# EAGLE design bbb_audio_decoder (EAGLE 7.7.0)
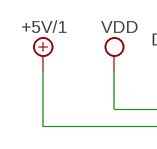
[diagram p0: schematic, sheet 1, part 1 of 2]
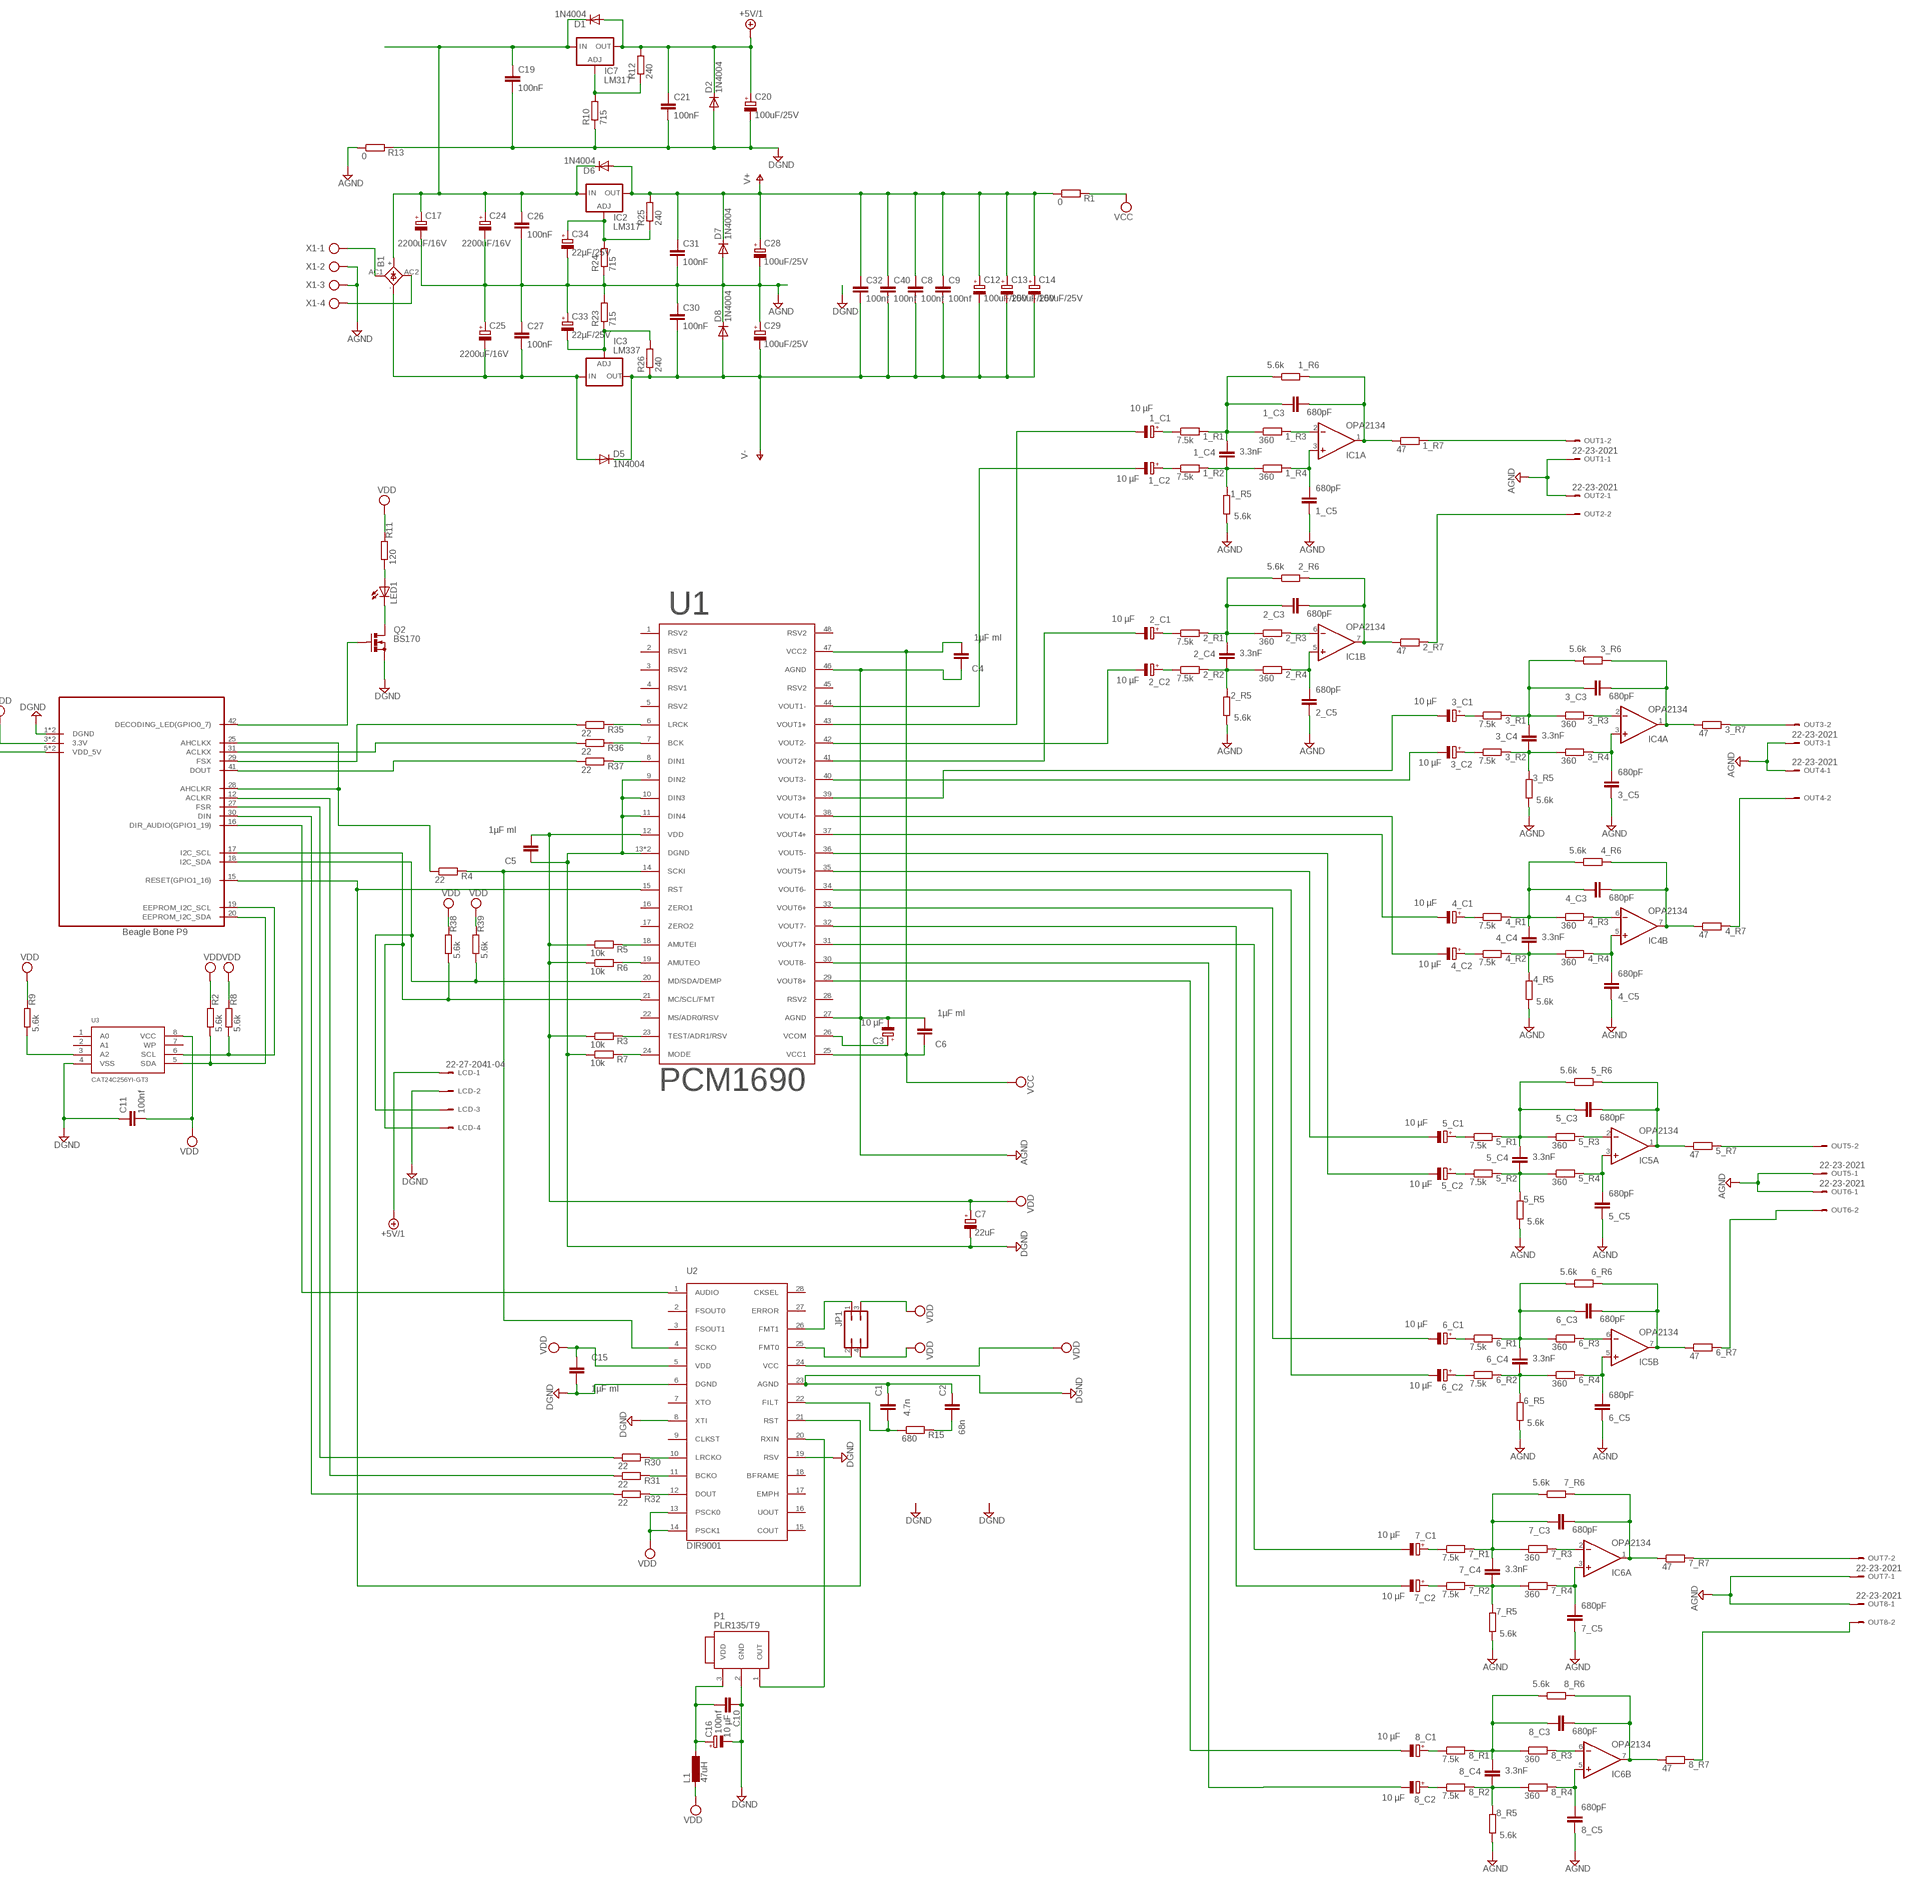
[diagram p1: schematic, sheet 1, part 2 of 2]

## Parts
1_C1  10 µF  CPOL-EUE2-5  [E2-5]
1_C2  10 µF  CPOL-EUE2-5  [E2-5]
1_C3  680pF  C-EU050-024X044  [C050-024X044]
1_C4  3.3nF  C-EU050-025X075  [C050-025X075]
1_C5  680pF  C-EU050-024X044  [C050-024X044]
1_R1  7.5k  R-EU_0207/7  [0207/7]
1_R2  7.5k  R-EU_0207/7  [0207/7]
1_R3  360  R-EU_0207/7  [0207/7]
1_R4  360  R-EU_0207/7  [0207/7]
1_R5  5.6k  R-EU_0207/7  [0207/7]
1_R6  5.6k  R-EU_0207/7  [0207/7]
1_R7  47  R-EU_0207/7  [0207/7]
2_C1  10 µF  CPOL-EUE2-5  [E2-5]
2_C2  10 µF  CPOL-EUE2-5  [E2-5]
2_C3  680pF  C-EU050-024X044  [C050-024X044]
2_C4  3.3nF  C-EU050-025X075  [C050-025X075]
2_C5  680pF  C-EU050-024X044  [C050-024X044]
2_R1  7.5k  R-EU_0207/7  [0207/7]
2_R2  7.5k  R-EU_0207/7  [0207/7]
2_R3  360  R-EU_0207/7  [0207/7]
2_R4  360  R-EU_0207/7  [0207/7]
2_R5  5.6k  R-EU_0207/7  [0207/7]
2_R6  5.6k  R-EU_0207/7  [0207/7]
2_R7  47  R-EU_0207/7  [0207/7]
3_C1  10 µF  CPOL-EUE2-5  [E2-5]
3_C2  10 µF  CPOL-EUE2-5  [E2-5]
3_C3  680pF  C-EU050-024X044  [C050-024X044]
3_C4  3.3nF  C-EU050-025X075  [C050-025X075]
3_C5  680pF  C-EU050-024X044  [C050-024X044]
3_R1  7.5k  R-EU_0207/7  [0207/7]
3_R2  7.5k  R-EU_0207/7  [0207/7]
3_R3  360  R-EU_0207/7  [0207/7]
3_R4  360  R-EU_0207/7  [0207/7]
3_R5  5.6k  R-EU_0207/7  [0207/7]
3_R6  5.6k  R-EU_0207/7  [0207/7]
3_R7  47  R-EU_0207/7  [0207/7]
4_C1  10 µF  CPOL-EUE2-5  [E2-5]
4_C2  10 µF  CPOL-EUE2-5  [E2-5]
4_C3  680pF  C-EU050-024X044  [C050-024X044]
4_C4  3.3nF  C-EU050-025X075  [C050-025X075]
4_C5  680pF  C-EU050-024X044  [C050-024X044]
4_R1  7.5k  R-EU_0207/7  [0207/7]
4_R2  7.5k  R-EU_0207/7  [0207/7]
4_R3  360  R-EU_0207/7  [0207/7]
4_R4  360  R-EU_0207/7  [0207/7]
4_R5  5.6k  R-EU_0207/7  [0207/7]
4_R6  5.6k  R-EU_0207/7  [0207/7]
4_R7  47  R-EU_0207/7  [0207/7]
5_C1  10 µF  CPOL-EUE2-5  [E2-5]
5_C2  10 µF  CPOL-EUE2-5  [E2-5]
5_C3  680pF  C-EU050-024X044  [C050-024X044]
5_C4  3.3nF  C-EU050-025X075  [C050-025X075]
5_C5  680pF  C-EU050-024X044  [C050-024X044]
5_R1  7.5k  R-EU_0207/7  [0207/7]
5_R2  7.5k  R-EU_0207/7  [0207/7]
5_R3  360  R-EU_0207/7  [0207/7]
5_R4  360  R-EU_0207/7  [0207/7]
5_R5  5.6k  R-EU_0207/7  [0207/7]
5_R6  5.6k  R-EU_0207/7  [0207/7]
5_R7  47  R-EU_0207/7  [0207/7]
6_C1  10 µF  CPOL-EUE2-5  [E2-5]
6_C2  10 µF  CPOL-EUE2-5  [E2-5]
6_C3  680pF  C-EU050-024X044  [C050-024X044]
6_C4  3.3nF  C-EU050-025X075  [C050-025X075]
6_C5  680pF  C-EU050-024X044  [C050-024X044]
6_R1  7.5k  R-EU_0207/7  [0207/7]
6_R2  7.5k  R-EU_0207/7  [0207/7]
6_R3  360  R-EU_0207/7  [0207/7]
6_R4  360  R-EU_0207/7  [0207/7]
6_R5  5.6k  R-EU_0207/7  [0207/7]
6_R6  5.6k  R-EU_0207/7  [0207/7]
6_R7  47  R-EU_0207/7  [0207/7]
7_C1  10 µF  CPOL-EUE2-5  [E2-5]
7_C2  10 µF  CPOL-EUE2-5  [E2-5]
7_C3  680pF  C-EU050-024X044  [C050-024X044]
7_C4  3.3nF  C-EU050-025X075  [C050-025X075]
7_C5  680pF  C-EU050-024X044  [C050-024X044]
7_R1  7.5k  R-EU_0207/7  [0207/7]
7_R2  7.5k  R-EU_0207/7  [0207/7]
7_R3  360  R-EU_0207/7  [0207/7]
7_R4  360  R-EU_0207/7  [0207/7]
7_R5  5.6k  R-EU_0207/7  [0207/7]
7_R6  5.6k  R-EU_0207/7  [0207/7]
7_R7  47  R-EU_0207/7  [0207/7]
8_C1  10 µF  CPOL-EUE2-5  [E2-5]
8_C2  10 µF  CPOL-EUE2-5  [E2-5]
8_C3  680pF  C-EU050-024X044  [C050-024X044]
8_C4  3.3nF  C-EU050-025X075  [C050-025X075]
8_C5  680pF  C-EU050-024X044  [C050-024X044]
8_R1  7.5k  R-EU_0207/7  [0207/7]
8_R2  7.5k  R-EU_0207/7  [0207/7]
8_R3  360  R-EU_0207/7  [0207/7]
8_R4  360  R-EU_0207/7  [0207/7]
8_R5  5.6k  R-EU_0207/7  [0207/7]
8_R6  5.6k  R-EU_0207/7  [0207/7]
8_R7  47  R-EU_0207/7  [0207/7]
B1  FB15  [FB15]
C1  4.7n  C-EU050-024X044  [C050-024X044]
C2  68n  C-EU050-024X044  [C050-024X044]
C3  10 µF  CPOL-EUE2-5  [E2-5]
C4  1µF ml  C-EU050-024X044  [C050-024X044]
C5  1µF ml  C-EU050-024X044  [C050-024X044]
C6  1µF ml  C-EU050-024X044  [C050-024X044]
C7  22uF  CPOL-EUE2-5  [E2-5]
C8  100nf  C-EU050-024X044  [C050-024X044]
C9  100nf  C-EU050-024X044  [C050-024X044]
C10  100nf  C-EU050-024X044  [C050-024X044]
C11  100nf  C-EU050-024X044  [C050-024X044]
C12  100uF/25V  CPOL-EUE2.5-6  [E2,5-6]
C13  100uF/25V  CPOL-EUE2.5-6  [E2,5-6]
C14  100uF/25V  CPOL-EUE2.5-6  [E2,5-6]
C15  1µF ml  C-EU050-024X044  [C050-024X044]
C16  10 µF  CPOL-EUE2-5  [E2-5]
C17  2200uF/16V  CPOL-EUE5-13  [E5-13]
C19  100nF  C-EU050-024X044  [C050-024X044]
C20  100uF/25V  CPOL-EUE2.5-6  [E2,5-6]
C21  100nF  C-EU050-024X044  [C050-024X044]
C24  2200uF/16V  CPOL-EUE5-13  [E5-13]
C25  2200uF/16V  CPOL-EUE5-13  [E5-13]
C26  100nF  C-EU050-024X044  [C050-024X044]
C27  100nF  C-EU050-024X044  [C050-024X044]
C28  100uF/25V  CPOL-EUE2.5-6  [E2,5-6]
C29  100uF/25V  CPOL-EUE2.5-6  [E2,5-6]
C30  100nF  C-EU050-024X044  [C050-024X044]
C31  100nF  C-EU050-024X044  [C050-024X044]
C32  100nf  C-EU050-024X044  [C050-024X044]
C33  22µF/25V  CPOL-EUE2.5-6  [E2,5-6]
C34  22µF/25V  CPOL-EUE2.5-6  [E2,5-6]
C40  100nf  C-EU050-024X044  [C050-024X044]
D1  1N4004  DIODE-DO41-7.6  [DO41-7.6]
D2  1N4004  DIODE-DO41-7.6  [DO41-7.6]
D5  1N4004  DIODE-DO41-7.6  [DO41-7.6]
D6  1N4004  DIODE-DO41-7.6  [DO41-7.6]
D7  1N4004  DIODE-DO41-7.6  [DO41-7.6]
D8  1N4004  DIODE-DO41-7.6  [DO41-7.6]
IC1  OPA2134  TL072P  [DIL8]
IC2  LM317  LM317TS  [317TS]
IC3  LM337  LM337TS  [337TS]
IC4  OPA2134  TL072P  [DIL8]
IC5  OPA2134  TL072P  [DIL8]
IC6  OPA2134  TL072P  [DIL8]
IC7  LM317  LM317TS  [317TS]
JP1  JP2Q  [JP2Q]
L1  47uH  L-EU0207/10  [0207/10]
LCD  22-27-2041-04  [6410-04]
LED1  LEDSMT1206  [1206]
OUT1  22-23-2021  [22-23-2021]
OUT2  22-23-2021  [22-23-2021]
OUT3  22-23-2021  [22-23-2021]
OUT4  22-23-2021  [22-23-2021]
OUT5  22-23-2021  [22-23-2021]
OUT6  22-23-2021  [22-23-2021]
OUT7  22-23-2021  [22-23-2021]
OUT8  22-23-2021  [22-23-2021]
P1  PLR135/T9  [PLR135/T9]
Q2  BS170  [SOT54E]
R1  0  R-EU_0204/2V  [0204V]
R2  5.6k  R-EU_0207/7  [0207/7]
R3  10k  R-EU_0207/7  [0207/7]
R4  22  R-EU_0207/7  [0207/7]
R5  10k  R-EU_0207/7  [0207/7]
R6  10k  R-EU_0207/7  [0207/7]
R7  10k  R-EU_0207/7  [0207/7]
R8  5.6k  R-EU_0207/7  [0207/7]
R9  5.6k  R-EU_0207/7  [0207/7]
R10  715  R-EU_0204/2V  [0204V]
R11  120  R-EU_0204/2V  [0204V]
R12  240  R-EU_0204/2V  [0204V]
R13  0  R-EU_0204/2V  [0204V]
R15  680  R-EU_0207/7  [0207/7]
R23  715  R-EU_0204/2V  [0204V]
R24  715  R-EU_0207/10  [0207/10]
R25  240  R-EU_0204/2V  [0204V]
R26  240  R-EU_0204/2V  [0204V]
R30  22  R-EU_0207/7  [0207/7]
R31  22  R-EU_0207/7  [0207/7]
R32  22  R-EU_0207/7  [0207/7]
R35  22  R-EU_0207/7  [0207/7]
R36  22  R-EU_0207/7  [0207/7]
R37  22  R-EU_0207/7  [0207/7]
R38  5.6k  R-EU_0207/7  [0207/7]
R39  5.6k  R-EU_0207/7  [0207/7]
U1  PCM1690  [HTSSOP48DFD]
U2  DIR9001  [TSSOP28]
U3  CAT24C256YI-GT3  [TSSOP8]
U$1  BEAGLEBONEP9  [HEADERS23-2]
X1  AK500/4  [AK500/4]

## Nets
ACLKR: R31.1 U$1.12(ACLKR)
ACLKX: R36.1 U$1.31(ACLKX)
AGND: 1_C5.1 1_R5.1 2_C5.1 2_R5.1 3_C5.1 3_R5.1 4_C5.1 4_R5.1 5_C5.1 5_R5.1 6_C5.1 6_R5.1 7_C5.1 7_R5.1 8_C5.1 8_R5.1 C3.- C4.1 C6.2 C17.- C24.- C25.+ C26.2 C27.1 C28.- C29.+ C30.1 C31.2 C33.+ C34.- D7.A D8.C OUT1.1 OUT2.1 OUT3.1 OUT4.1 OUT5.1 OUT6.1 OUT7.1 OUT8.1 R13.1 R23.2 R24.1 U1.27(AGND) U1.46(AGND) X1.2 X1.3
CAPE_I2C_SCL: R8.1 U3.6(SCL) U$1.19(EEPROM_I2C_SCL)
CAPE_I2C_SDA: R2.1 U3.5(SDA) U$1.20(EEPROM_I2C_SDA)
DGND: C1.1 C2.1 C5.1 C7.- C10.1 C11.1 C15.2 C16.- C19.2 C20.- C21.2 D2.A LCD.2 P1.2(GND) Q2.S R7.1 R10.1 R13.2 U1.9(DIN2) U1.10(DIN3) U1.11(DIN4) U1.13(DGND) U1.EXP(DGND) U2.6(DGND) U2.8(XTI) U2.19(RSV) U2.23(AGND) U3.4(VSS) U$1.1(DGND) U$1.2(DGND)
DIN: R32.1 U$1.30(DIN)
DIR_AUDIO: U2.1(AUDIO) U$1.16(DIR_AUDIO(GPIO1_19))
DOUT: R37.1 U$1.41(DOUT)
FILT: C1.2 R15.1 U2.22(FILT)
FSR: R30.1 U$1.27(FSR)
FSX: R35.1 U$1.29(FSX)
MCLK: R4.1 U$1.25(AHCLKX) U$1.28(AHCLKR)
N$1: B1.AC2 X1.4
N$2: R3.2 U1.23(TEST/ADR1/RSV)
N$3: B1.AC1 X1.1
N$4: LED1.A R11.1
N$5: R4.2 U1.14(SCKI) U2.4(SCKO)
N$6: C2.2 R15.2
N$7: JP1.2 U2.25(FMT0)
N$8: JP1.1 U2.26(FMT1)
N$9: 3_C4.1 3_R2.2 3_R4.1 3_R5.2
N$10: 3_C3.1 3_C4.2 3_R1.2 3_R3.1 3_R6.1
N$11: R5.2 U1.18(AMUTEI)
N$12: C10.2 C16.+ L1.1 P1.3(VDD)
N$13: 1_C4.1 1_R2.2 1_R4.1 1_R5.2
N$14: 2_C4.1 2_R2.2 2_R4.1 2_R5.2
N$15: 2_C3.1 2_C4.2 2_R1.2 2_R3.1 2_R6.1
N$16: 3_C5.2 3_R4.2 IC4.3(A:+IN)
N$17: R6.2 U1.19(AMUTEO)
N$18: 1_C3.1 1_C4.2 1_R1.2 1_R3.1 1_R6.1
N$19: R7.2 U1.24(MODE)
N$20: P1.1(OUT) U2.20(RXIN)
N$21: 3_C3.2 3_R6.2 3_R7.1 IC4.1(A:OUT)
N$22: 3_R3.2 IC4.2(A:-IN)
N$23: 1_R3.2 IC1.2(A:-IN)
N$24: 1_C5.2 1_R4.2 IC1.3(A:+IN)
N$25: 1_C2.+ 1_R2.1
N$26: 1_C3.2 1_R6.2 1_R7.1 IC1.1(A:OUT)
N$27: 1_C1.+ 1_R1.1
N$28: LED1.C Q2.D
N$29: 7_C4.1 7_R2.2 7_R4.1 7_R5.2
N$30: 2_C5.2 2_R4.2 IC1.5(B:+IN)
N$31: 2_C3.2 2_R6.2 2_R7.1 IC1.7(B:OUT)
N$32: 2_R3.2 IC1.6(B:-IN)
N$33: 2_C2.+ 2_R2.1
N$34: 2_C1.+ 2_R1.1
N$35: 7_C3.1 7_C4.2 7_R1.2 7_R3.1 7_R6.1
N$36: 7_C5.2 7_R4.2 IC6.3(A:+IN)
N$37: 1_R7.2 OUT1.2
N$38: 2_R7.2 OUT2.2
N$39: B1.+ C17.+ C19.1 C24.+ C26.1 D1.C D6.C IC2.3(IN) IC7.3(IN)
N$40: IC7.1(ADJ) R10.2 R12.1
N$41: B1.- C25.- C27.2 D5.A IC3.2(IN)
N$42: C33.- IC3.1(ADJ) R23.1 R26.2
N$43: C34.+ IC2.1(ADJ) R24.2 R25.1
N$44: 3_C2.+ 3_R2.1
N$45: 3_C1.+ 3_R1.1
N$46: 7_C3.2 7_R6.2 7_R7.1 IC6.1(A:OUT)
N$47: 7_R3.2 IC6.2(A:-IN)
N$48: 4_C4.1 4_R2.2 4_R4.1 4_R5.2
N$49: 4_C3.1 4_C4.2 4_R1.2 4_R3.1 4_R6.1
N$50: 4_C5.2 4_R4.2 IC4.5(B:+IN)
N$51: R32.2 U2.12(DOUT)
N$52: R31.2 U2.11(BCKO)
N$53: R30.2 U2.10(LRCKO)
N$54: R9.1 U3.3(A2)
N$55: 4_C3.2 4_R6.2 4_R7.1 IC4.7(B:OUT)
N$56: 4_R3.2 IC4.6(B:-IN)
N$57: 4_C2.+ 4_R2.1
N$58: 4_C1.+ 4_R1.1
N$59: 7_C2.+ 7_R2.1
N$60: 7_C1.+ 7_R1.1
N$61: R37.2 U1.8(DIN1)
N$62: R36.2 U1.7(BCK)
N$63: R35.2 U1.6(LRCK)
N$64: 3_R7.2 OUT3.2
N$65: 4_R7.2 OUT4.2
N$66: 5_C4.1 5_R2.2 5_R4.1 5_R5.2
N$67: 5_C3.1 5_C4.2 5_R1.2 5_R3.1 5_R6.1
N$68: 5_C5.2 5_R4.2 IC5.3(A:+IN)
N$69: 5_C3.2 5_R6.2 5_R7.1 IC5.1(A:OUT)
N$70: 5_R3.2 IC5.2(A:-IN)
N$71: 5_C2.+ 5_R2.1
N$72: 5_C1.+ 5_R1.1
N$73: 8_C4.1 8_R2.2 8_R4.1 8_R5.2
N$74: 8_C3.1 8_C4.2 8_R1.2 8_R3.1 8_R6.1
N$75: 6_C4.1 6_R2.2 6_R4.1 6_R5.2
N$76: 6_C3.1 6_C4.2 6_R1.2 6_R3.1 6_R6.1
N$77: 6_C5.2 6_R4.2 IC5.5(B:+IN)
N$78: 6_C3.2 6_R6.2 6_R7.1 IC5.7(B:OUT)
N$79: 6_R3.2 IC5.6(B:-IN)
N$80: 6_C2.+ 6_R2.1
N$81: 6_C1.+ 6_R1.1
N$82: 5_R7.2 OUT5.2
N$83: 6_R7.2 OUT6.2
N$84: 8_C5.2 8_R4.2 IC6.5(B:+IN)
N$85: 8_C3.2 8_R6.2 8_R7.1 IC6.7(B:OUT)
N$86: 8_R3.2 IC6.6(B:-IN)
N$87: 8_C2.+ 8_R2.1
N$88: 8_C1.+ 8_R1.1
N$89: 7_R7.2 OUT7.2
N$90: 8_R7.2 OUT8.2
N$94: Q2.G U$1.42(DECODING_LED(GPIO0_7))
RST: U1.15(RST) U2.21(RST) U$1.15(RESET(GPIO1_16))
SCL: LCD.4 R38.1 U1.21(MC/SCL/FMT) U$1.17(I2C_SCL)
SDA: LCD.3 R39.1 U1.20(MD/SDA/DEMP) U$1.18(I2C_SDA)
V+: C8.1 C9.1 C12.+ C13.+ C14.+ C28.+ C31.1 C32.1 C40.1 D6.A D7.C IC2.2(OUT) R1.1 R25.2
V-: C8.2 C9.2 C12.- C13.- C14.- C29.- C30.2 C32.2 C40.2 D5.C D8.A IC3.3(OUT) R26.1
VCC: C4.2 C6.1 R1.2 U1.25(VCC1) U1.47(VCC2)
VCOM: C3.+ U1.26(VCOM)
VDD: C5.2 C7.+ C11.2 C15.1 JP1.3 JP1.4 L1.2 R2.2 R3.1 R5.1 R6.1 R8.2 R9.2 R11.2 R38.2 R39.2 U1.12(VDD) U2.5(VDD) U2.13(PSCK0) U2.14(PSCK1) U2.24(VCC) U3.8(VCC) U$1.3(3.3V) U$1.4(3.3V)
VDD_5V: C20.+ C21.1 D1.A D2.C IC7.2(OUT) LCD.1 R12.2 U$1.5(VDD_5V) U$1.6(VDD_5V) ; supply symbol labelled +5V/1
VOUT1+: 1_C1.- U1.43(VOUT1+)
VOUT1-: 1_C2.- U1.44(VOUT1-)
VOUT2+: 2_C1.- U1.41(VOUT2+)
VOUT2-: 2_C2.- U1.42(VOUT2-)
VOUT3+: 3_C1.- U1.39(VOUT3+)
VOUT3-: 3_C2.- U1.40(VOUT3-)
VOUT4+: 4_C1.- U1.37(VOUT4+)
VOUT4-: 4_C2.- U1.38(VOUT4-)
VOUT5+: 5_C1.- U1.35(VOUT5+)
VOUT5-: 5_C2.- U1.36(VOUT5-)
VOUT6+: 6_C1.- U1.33(VOUT6+)
VOUT6-: 6_C2.- U1.34(VOUT6-)
VOUT7+: 7_C1.- U1.31(VOUT7+)
VOUT7-: 7_C2.- U1.32(VOUT7-)
VOUT8+: 8_C1.- U1.29(VOUT8+)
VOUT8-: 8_C2.- U1.30(VOUT8-)
Unconnected: U1.1(RSV2) U1.2(RSV1) U1.3(RSV2) U1.4(RSV1) U1.5(RSV2) U1.16(ZERO1) U1.17(ZERO2) U1.22(MS/ADR0/RSV) U1.28(RSV2) U1.45(RSV2) U1.48(RSV2) U2.2(FSOUT0) U2.3(FSOUT1) U2.7(XTO) U2.9(CLKST) U2.15(COUT) U2.16(UOUT) U2.17(EMPH) U2.18(BFRAME) U2.27(ERROR) U2.28(CKSEL) U3.1(A0) U3.2(A1) U3.7(WP)

## Power pins joined to a net without a drawn wire
V+: IC1.8(P:V+) IC4.8(P:V+) IC5.8(P:V+) IC6.8(P:V+)
V-: IC1.4(P:V-) IC4.4(P:V-) IC5.4(P:V-) IC6.4(P:V-)

## Library data of the parts
1_C1 1_C2 2_C1 2_C2 3_C1 3_C2 4_C1 4_C2 5_C1 5_C2 6_C1 6_C2 7_C1 7_C2 8_C1 8_C2 C3 C7 C12-C14 C16 C17 C20 C24 C25 C28 C29 C33 C34 = rcl:CPOL-EU: POLARIZED CAPACITOR, European symbol
1_C3-1_C5 2_C3-2_C5 3_C3-3_C5 4_C3-4_C5 5_C3-5_C5 6_C3-6_C5 7_C3-7_C5 8_C3-8_C5 C1 C2 C4-C6 C8-C11 C15 C19 C21 C26 C27 C30-C32 C40 = rcl:C-EU: CAPACITOR, European symbol
1_R1-1_R7 2_R1-2_R7 3_R1-3_R7 4_R1-4_R7 5_R1-5_R7 6_R1-6_R7 7_R1-7_R7 8_R1-8_R7 R1-R13 R15 R23-R26 R30-R32 R35-R39 = rcl:R-EU_: RESISTOR, European symbol
B1 = rectifier:FB15: FAGOR RECTIFIER grid 3 x 5 mm
D1 D2 D5-D8 = diode:DIODE-: DIODE
IC1 IC4-IC6 = 0000halfgaar:TL072: TL072 dual opamp
IC2 IC7 = v-reg:LM317TS: VOLTAGE REGULATOR
IC3 = v-reg:LM337TS: VOLTAGE REGULATOR
JP1 = jumper:JP2Q: JUMPER
L1 = rcl:L-EU: INDUCTOR, European symbol
LCD = con-molex:22-?-04: CONNECTOR wire to board 2.54 mm (.1 inch) pitch header; OC_FARNELL: unknown; OC_NEWARK: unknown
LED1 = led:LED: LED OSRAM: - CHIPLED LG R971, LG N971, LY N971, LG Q971, LY Q971, LO R971, LY R971 LH N974, LH R974 LS Q976, LO Q976, LY Q976 LO Q996 - Hyper CHIPLED LW Q18S LB Q993, LB Q99A, LB R99A - SideLED LS A670, LO A670, LY A670, LG A670, LP A670 LB A673, LV A673, LT A673, LW A673 LH A674 LY A675 LS A676, LA A676, LO A676, LY A676, LW A676 LS A679, LY A679, LG A679 - Hyper Micro SIDELED® LS Y876, LA Y876, LO Y876, LY Y876 LT Y87S - SmartLED LW L88C, LW L88S LB L89C, LB L89S, LG L890 LS L89K, LO L89K, LY L89K LS L896, LA L896, LO L896, LY L896 - TOPLED LS T670, LO T670, LY T670, LG T670, LP T670 LSG T670, LSP T670, LSY T670, LOP T670, LYG T670 LG T671, LOG T671, LSG T671 LB T673, LV T673, LT T673, LW T673 LH T674 LS T676, LA T676, LO T676, LY T676, LB T676, LH T676, LSB T676, LW T676 LB T67C, LV T67C, LT T67C, LS T67K, LO T67K, LY T67K, LW E67C LS E67B, LA E67B, LO E67B, LY E67B, LB E67C, LV E67C, LT E67C LW T67C LS T679, LY T679, LG T679 LS T770, LO T770, LY T770, LG T770, LP T770 LB T773, LV T773, LT T773, LW T773 LH T774 LS E675, LA E675, LY E675, LS T675 LS T776, LA T776, LO T776, LY T776, LB T776 LHGB T686 LT T68C, LB T68C - Hyper Mini TOPLED® LB M676 - Mini TOPLED Santana® LG M470 LS M47K, LO M47K, LY M47K Source: http://www.osram.convergy.de LUXEON: - LUMILED® LXK2-PW12-R00, LXK2-PW12-S00, LXK2-PW14-U00, LXK2-PW14-V00 LXK2-PM12-R00, LXK2-PM12-S00, LXK2-PM14-U00 LXK2-PE12-Q00, LXK2-PE12-R00, LXK2-PE12-S00, LXK2-PE14-T00, LXK2-PE14-U00 LXK2-PB12-K00, LXK2-PB12-L00, LXK2-PB12-M00, LXK2-PB14-N00, LXK2-PB14-P00, LXK2-PB14-Q00 LXK2-PR12-L00, LXK2-PR12-M00, LXK2-PR14-Q00, LXK2-PR14-R00 LXK2-PD12-Q00, LXK2-PD12-R00, LXK2-PD12-S00 LXK2-PH12-R00, LXK2-PH12-S00 LXK2-PL12-P00, LXK2-PL12-Q00, LXK2-PL12-R00 Source: www.luxeon.com KINGBRIGHT: KA-3528ASYC Source: www.kingbright.com
OUT1-OUT8 = con-molex:22-23-2021: .100" (2.54mm) Center Header - 2 Pin; MF: MOLEX; MPN: 22-23-2021; OC_FARNELL: 1462926; OC_NEWARK: 25C3832
P1 = 0000halfgaar:PLR135/T9: PLR135/T9 Optical Receiver
Q2 = transistor-small-signal:BS170: N-CHANNEL MOS FET
U1 = 0000halfgaar:PCM1690: PCM1690 24-Bit, 192-kHz Sampling, Enhanced Multi-Level ΔΣ, Eight-Channel Audio Digital-to-Analog Converter
U2 = 0000halfgaar:DIR9001: DIR9001 DIR9001 Digital audio interface receiver
U3 = 0000halfgaar:CAT24C256: CAT24C256 EEPROM, the one the Beagle Bone Black wants
U$1 = 0000halfgaar:BEAGLEBONEP9: Beagle Bone green/black P9 I2s / mcasp function
X1 = con-ptr500:AK500/4: CONNECTOR; OC_FARNELL: unknown; OC_NEWARK: unknown

## Board
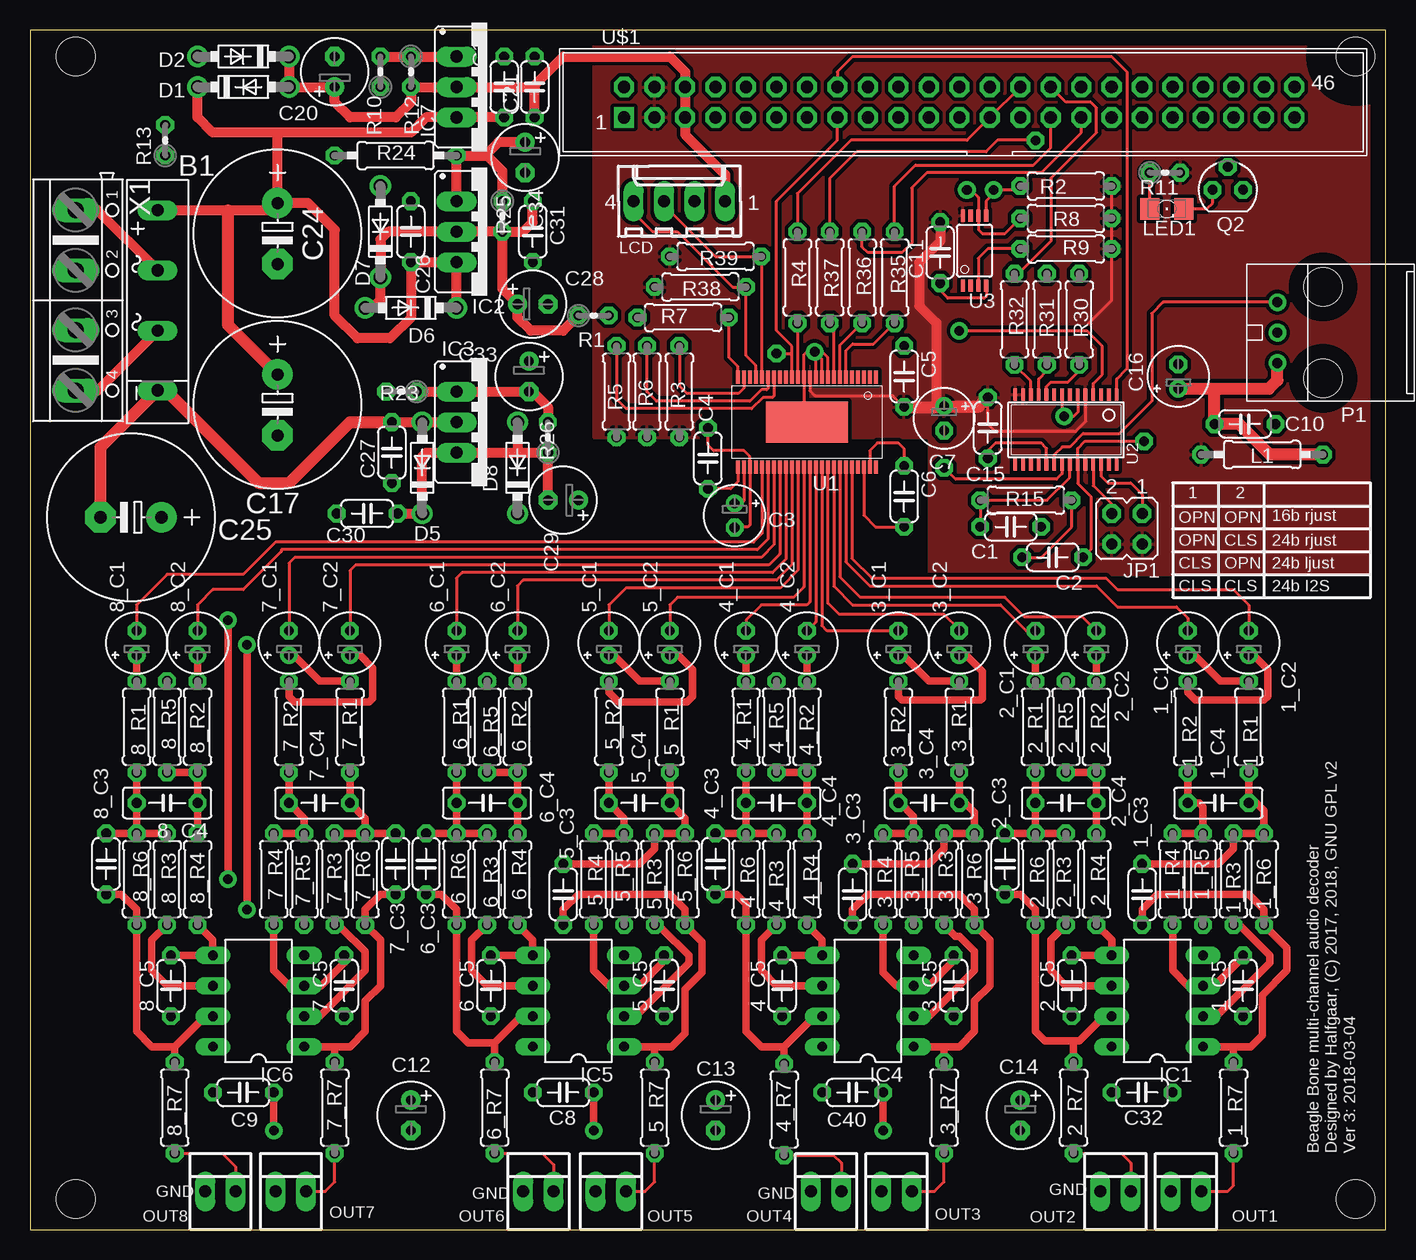
[diagram p2: board, top side]
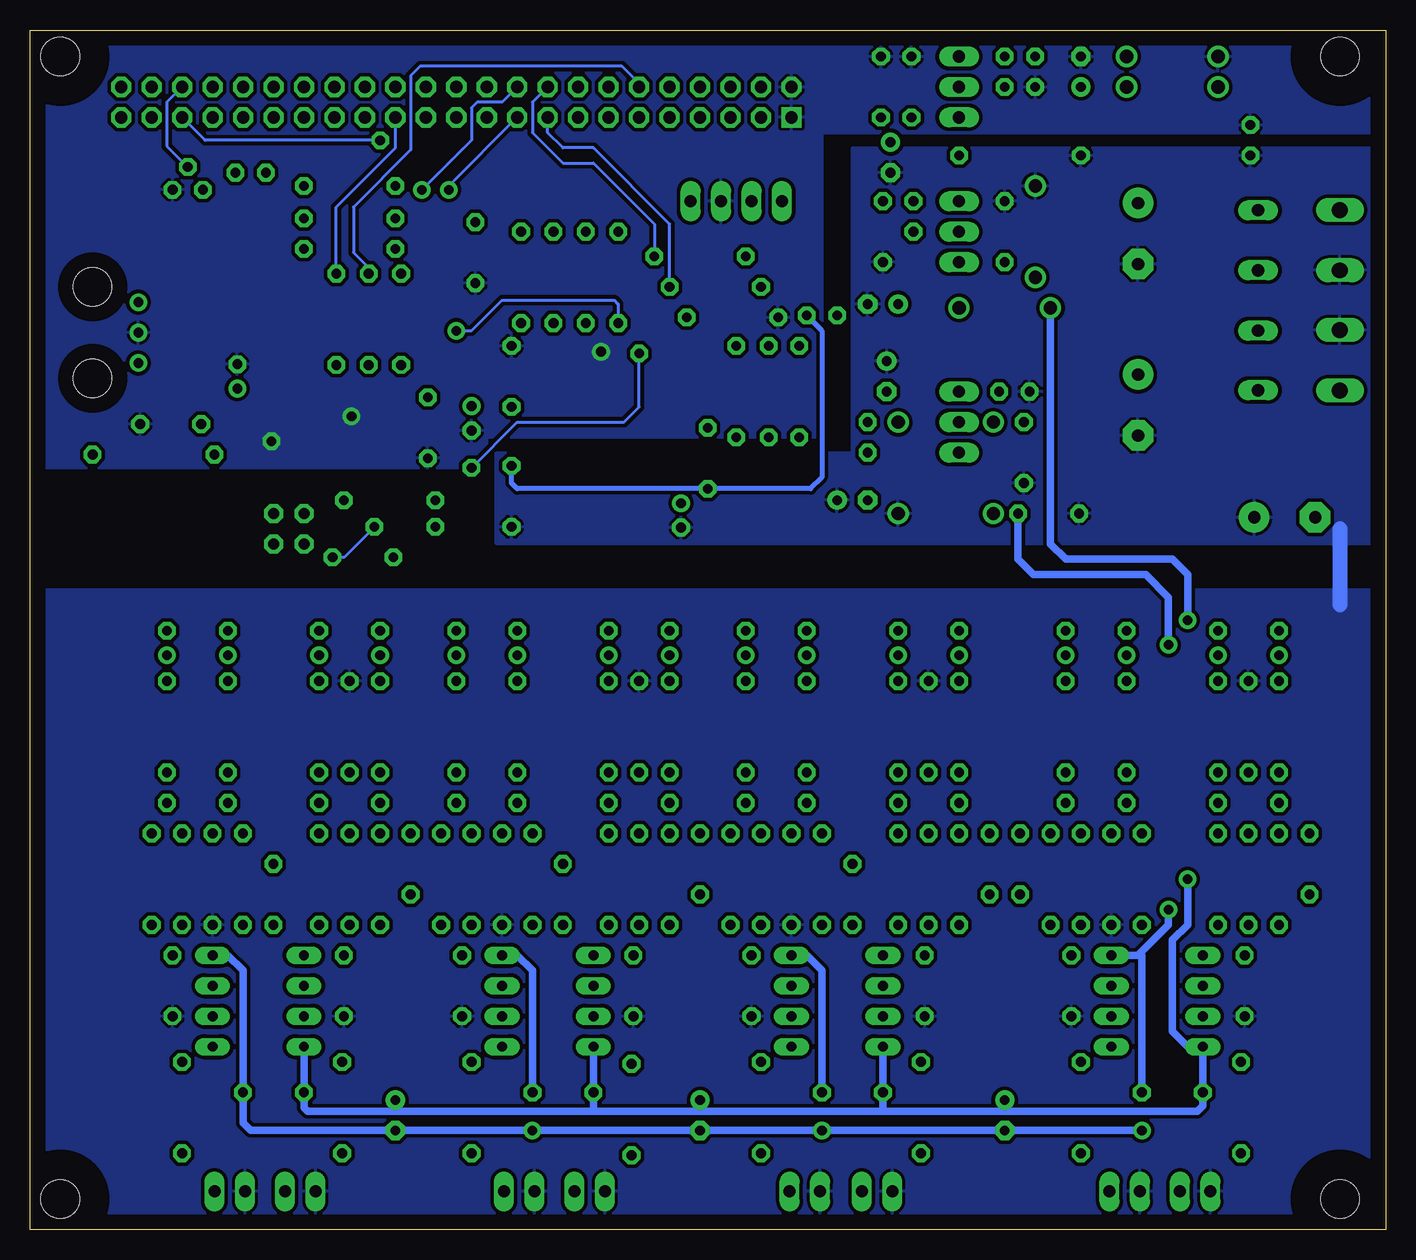
[diagram p3: board, bottom side, seen from below]

Size 113.01 x 100 mm. Coordinates in mm from the lower left corner, seen from the top.
Outline: 0,0 113.01,0 113.01,100 0,100 0,0
Copper layers (1*16): Top 0.035mm / dielectric 1.6mm / Bottom 0.035mm
Design rules "verysmall": minimum track width 10mil, minimum drill 31mil, track to track 9mil, track to pad 8mil, pad to pad 7mil, via to via 20mil, smd to smd 7mil, copper to edge 50mil, drill to drill 40mil, minimum pad ring 13mil, minimum via ring 13mil, stop-mask expansion 4mil, vias tented up to drill 0mil, thermal gap 10mil
Holes 3.2 mm at 3.81,97.79 110.49,97.79 110.49,2.54 3.81,2.54
tRestrict: area 106.9,94.2 to 114.1,101.4
bRestrict: area 0.2,94.2 to 7.4,101.4; area 0.2,-1.1 to 7.4,6.1; area 106.9,-1.1 to 114.1,6.1; area 106.9,94.2 to 114.1,101.4

### Footprints (pad centres in the part's own frame; a part is rotated, then mirrored left to right if it is on the bottom)
E2-5 = drill 0.813 pad 1.27: + -1.016,0 | drill 0.813 pad 1.27 octagon: - 1.016,0
C050-024X044 = drill 0.813 octagon: 1 -2.54,0; 2 2.54,0
C050-025X075 = drill 0.813 octagon: 1 -2.54,0; 2 2.54,0
0207/7 = drill 0.813 octagon: 1 -3.81,0; 2 3.81,0
FB15 = drill 1.016 long: + -7.5,0; - 7.511,0; AC1 -2.496,0; AC2 2.533,0
E2,5-6 = drill 0.813 pad 1.6: + -1.27,0 | drill 0.813 pad 1.6 octagon: - 1.27,0
E5-13 = drill 1.016 pad 2.54: + -2.54,0 | drill 1.016 pad 2.54 octagon: - 2.54,0
DO41-7.6 = drill 1.1 pad 1.7: A 3.81,0; C -3.81,0
DIL8 = drill 0.813 long: 1 -3.81,-3.81; 2 -1.27,-3.81; 3 1.27,-3.81; 4 3.81,-3.81; 5 3.81,3.81; 6 1.27,3.81; 7 -1.27,3.81; 8 -3.81,3.81
317TS = drill 1.016 long: 1 -2.54,-2.54; 2 0,-2.54; 3 2.54,-2.54
337TS = drill 1.016 long: 1 -2.54,-2.54; 2 0,-2.54; 3 2.54,-2.54
JP2Q = drill 0.914 octagon: 1 -1.27,-1.27; 2 1.27,-1.27; 3 -1.27,1.27; 4 1.27,1.27
0207/10 = drill 0.813 octagon: 1 -5.08,0; 2 5.08,0
6410-04 = drill 1.016 long: 1 3.81,0; 2 1.27,0; 3 -1.27,0; 4 -3.81,0
1206 = smd 1.6 x 1.803: A -1.422,0; C 1.422,0
22-23-2021 = drill 1 long: 1 -1.27,0; 2 1.27,0
PLR135/T9 = drill 0.8 pad 1.422: 1 8.255,11.43; 2 5.715,11.43; 3 3.175,11.43 | hole 3.2: 1.905,7.62; 9.525,7.62
SOT54E = drill 0.813 octagon: D -1.27,0; G 0,1.905; S 1.27,0
0204V = drill 0.813 octagon: 1 -1.27,0; 2 1.27,0
HTSSOP48DFD = smd 0.3 x 1.1: 1 -5.75,-3.75; 2 -5.25,-3.75; 3 -4.75,-3.75; 4 -4.25,-3.75; 5 -3.75,-3.75; 6 -3.25,-3.75; 7 -2.75,-3.75; 8 -2.25,-3.75; 9 -1.75,-3.75; 10 -1.25,-3.75; 11 -0.75,-3.75; 12 -0.25,-3.75; 13 0.25,-3.75; 14 0.75,-3.75; 15 1.25,-3.75; 16 1.75,-3.75; 17 2.25,-3.75; 18 2.75,-3.75; 19 3.25,-3.75; 20 3.75,-3.75; 21 4.25,-3.75; 22 4.75,-3.75; 23 5.25,-3.75; 24 5.75,-3.75; 25 5.75,3.75; 26 5.25,3.75; 27 4.75,3.75; 28 4.25,3.75; 29 3.75,3.75; 30 3.25,3.75; 31 2.75,3.75; 32 2.25,3.75; 33 1.75,3.75; 34 1.25,3.75; 35 0.75,3.75; 36 0.25,3.75; 37 -0.25,3.75; 38 -0.75,3.75; 39 -1.25,3.75; 40 -1.75,3.75; 41 -2.25,3.75; 42 -2.75,3.75; 43 -3.25,3.75; 44 -3.75,3.75; 45 -4.25,3.75; 46 -4.75,3.75; 47 -5.25,3.75; 48 -5.75,3.75 | smd 6.858 x 3.4: EXP 0,0
TSSOP28 = smd 0.305 x 0.991: 1 -4.225,-2.918; 2 -3.575,-2.918; 3 -2.925,-2.918; 4 -2.275,-2.918; 5 -1.625,-2.918; 6 -0.975,-2.918; 7 -0.325,-2.918; 8 0.325,-2.918; 9 0.975,-2.918; 10 1.625,-2.918; 11 2.275,-2.918; 12 2.925,-2.918; 13 3.575,-2.918; 14 4.225,-2.918; 15 4.225,2.918; 16 3.575,2.918; 17 2.925,2.918; 18 2.275,2.918; 19 1.625,2.918; 20 0.975,2.918; 21 0.325,2.918; 22 -0.325,2.918; 23 -0.975,2.918; 24 -1.625,2.918; 25 -2.275,2.918; 26 -2.925,2.918; 27 -3.575,2.918; 28 -4.225,2.918
TSSOP8 = smd 0.35 x 1: 1 -0.975,-2.925; 2 -0.325,-2.925; 3 0.325,-2.925; 4 0.975,-2.925; 5 0.975,2.925; 6 0.325,2.925; 7 -0.325,2.925; 8 -0.975,2.925
HEADERS23-2 = drill 1.016 square: 1 -5.08,-1.27 | drill 1.016 octagon: 2 -5.08,1.27; 3 -2.54,-1.27; 4 -2.54,1.27; 5 0,-1.27; 6 0,1.27; 7 2.54,-1.27; 8 2.54,1.27; 9 5.08,-1.27; 10 5.08,1.27; 11 7.62,-1.27; 12 7.62,1.27; 13 10.16,-1.27; 14 10.16,1.27; 15 12.7,-1.27; 16 12.7,1.27; 17 15.24,-1.27; 18 15.24,1.27; 19 17.78,-1.27; 20 17.78,1.27; 21 20.32,-1.27; 22 20.32,1.27; 23 22.86,-1.27; 24 22.86,1.27; 25 25.4,-1.27; 26 25.4,1.27; 27 27.94,-1.27; 28 27.94,1.27; 29 30.48,-1.27; 30 30.48,1.27; 31 33.02,-1.27; 32 33.02,1.27; 33 35.56,-1.27; 34 35.56,1.27; 35 38.1,-1.27; 36 38.1,1.27; 37 40.64,-1.27; 38 40.64,1.27; 39 43.18,-1.27; 40 43.18,1.27; 41 45.72,-1.27; 42 45.72,1.27; 43 48.26,-1.27; 44 48.26,1.27; 45 50.8,-1.27; 46 50.8,1.27
AK500/4 = drill 1.321 long: 1 -7.518,0; 2 -2.489,0; 3 2.489,0; 4 7.518,0

### Placement (x,y rotation side)
1_C1  96.52,48.9 90 top
1_C2  101.6,48.9 90 top
1_C3  92.71,27.94 270 top
1_C4  99.06,35.56 0 top
1_C5  101.12,20.32 90 top
1_R1  101.6,41.91 270 top
1_R2  96.52,41.91 270 top
1_R3  100.33,29.21 270 top
1_R4  95.25,29.21 270 top
1_R5  97.79,29.21 90 top
1_R6  102.87,29.21 270 top
1_R7  100.33,10.16 270 top
2_C1  83.82,48.9 90 top
2_C2  88.9,48.9 90 top
2_C3  81.28,30.48 270 top
2_C4  86.36,35.56 180 top
2_C5  86.84,20.32 90 top
2_R1  83.82,41.91 270 top
2_R2  88.9,41.91 270 top
2_R3  86.36,29.21 270 top
2_R4  88.9,29.21 270 top
2_R5  86.36,41.91 270 top
2_R6  83.82,29.21 270 top
2_R7  87,10.16 270 top
3_C1  72.39,48.9 90 top
3_C2  77.47,48.9 90 top
3_C3  68.58,27.94 270 top
3_C4  74.93,35.56 0 top
3_C5  76.99,20.32 90 top
3_R1  77.47,41.91 270 top
3_R2  72.39,41.91 270 top
3_R3  76.2,29.21 270 top
3_R4  71.12,29.21 270 top
3_R5  73.66,29.21 90 top
3_R6  78.74,29.21 270 top
3_R7  76.2,10.16 270 top
4_C1  59.69,48.9 90 top
4_C2  64.77,48.9 90 top
4_C3  57.15,30.48 270 top
4_C4  62.23,35.56 180 top
4_C5  62.71,20.32 90 top
4_R1  59.69,41.91 270 top
4_R2  64.77,41.91 270 top
4_R3  62.23,29.21 270 top
4_R4  64.77,29.21 270 top
4_R5  62.23,41.91 270 top
4_R6  59.69,29.21 270 top
4_R7  62.87,10 270 top
5_C1  48.26,48.9 90 top
5_C2  53.34,48.9 90 top
5_C3  44.45,27.94 270 top
5_C4  50.8,35.56 0 top
5_C5  52.86,20.32 90 top
5_R1  53.34,41.91 270 top
5_R2  48.26,41.91 270 top
5_R3  52.07,29.21 270 top
5_R4  46.99,29.21 270 top
5_R5  49.53,29.21 90 top
5_R6  54.61,29.21 270 top
5_R7  52.07,10.16 270 top
6_C1  35.56,48.9 90 top
6_C2  40.64,48.9 90 top
6_C3  33.02,30.48 270 top
6_C4  38.1,35.56 180 top
6_C5  38.42,20.32 90 top
6_R1  35.56,41.91 270 top
6_R2  40.64,41.91 270 top
6_R3  38.1,29.21 270 top
6_R4  40.64,29.21 270 top
6_R5  38.1,41.91 270 top
6_R6  35.56,29.21 270 top
6_R7  38.73,10.16 270 top
7_C1  21.59,48.9 90 top
7_C2  26.67,48.9 90 top
7_C3  30.48,30.48 270 top
7_C4  24.13,35.56 0 top
7_C5  26.19,20.32 90 top
7_R1  26.67,41.91 270 top
7_R2  21.59,41.91 270 top
7_R3  25.4,29.21 270 top
7_R4  20.32,29.21 270 top
7_R5  22.86,29.21 90 top
7_R6  27.94,29.21 270 top
7_R7  25.4,10.16 270 top
8_C1  8.89,48.9 90 top
8_C2  13.97,48.9 90 top
8_C3  6.35,30.48 270 top
8_C4  11.43,35.56 180 top
8_C5  11.75,20.32 90 top
8_R1  8.89,41.91 270 top
8_R2  13.97,41.91 270 top
8_R3  11.43,29.21 270 top
8_R4  13.97,29.21 270 top
8_R5  11.43,41.91 270 top
8_R6  8.89,29.21 270 top
8_R7  12.06,10.16 270 top
B1  10.64,77.47 270 top
C1  81.76,58.58 180 top
C2  85.25,56.04 180 top
C3  58.74,59.53 270 top
C4  56.52,64.29 270 top
C5  72.87,71.12 270 top
C6  72.87,61.12 270 top
C7  76.2,67.63 270 top
C8  44.45,11.43 0 top
C9  17.78,11.43 0 top
C10  101.28,67.15 180 top
C11  75.88,81.44 90 top
C12  31.75,9.53 270 top
C13  57.15,9.53 270 top
C14  82.55,9.53 270 top
C15  79.85,66.83 270 top
C16  95.73,71.12 90 top
C17  20.64,68.74 270 top
C19  39.53,95.25 90 top
C20  25.4,96.52 90 top
C21  42.07,95.25 90 top
C24  20.64,83.03 270 top
C25  8.41,59.37 180 top
C26  31.75,83.19 90 top
C27  30.16,64.77 90 top
C28  41.91,77.15 0 top
C29  44.45,60.8 180 top
C30  28.1,59.69 0 top
C31  41.91,83.19 270 top
C32  92.71,11.43 0 top
C33  41.59,71.12 270 top
C34  41.27,89.38 270 top
C40  68.58,11.43 0 top
D1  17.78,95.25 0 top
D2  17.78,97.79 180 top
D5  32.7,63.5 90 top
D6  31.75,76.83 180 top
D7  29.21,83.19 90 top
D8  40.64,63.5 90 top
IC1  93.98,19.05 90 top
IC2  38.1,83.19 270 top
IC3  38.1,67.31 270 top
IC4  69.85,19.05 90 top
IC5  45.72,19.05 90 top
IC6  19.05,19.05 90 top
IC7  38.1,95.25 270 top
JP1  91.44,58.42 180 top
L1  102.71,64.61 180 top
LCD  54.13,85.72 0 top
LED1  94.77,85.09 0 top
OUT1  96.36,3.17 0 top
OUT2  90.49,3.17 0 top
OUT3  72.23,3.17 0 top
OUT4  66.36,3.17 0 top
OUT5  48.42,3.17 0 top
OUT6  42.39,3.17 0 top
OUT7  21.75,3.17 0 top
OUT8  15.88,3.17 0 top
P1  115.41,69.06 90 top
Q2  99.85,86.68 0 top
R1  46.99,76.2 0 top
R2  86.36,87 0 top
R3  54.13,69.85 90 top
R4  63.98,79.38 270 top
R5  48.9,69.85 90 top
R6  51.44,69.85 90 top
R7  54.45,76.04 0 top
R8  86.36,84.3 0 top
R9  86.36,81.76 0 top
R10  29.21,96.52 90 top
R11  94.61,88.11 0 top
R12  31.75,96.52 270 top
R13  11.27,90.81 90 top
R15  83.03,60.8 0 top
R23  30.96,69.85 180 top
R24  30.48,89.53 0 top
R25  39.37,84.45 270 top
R26  43.18,66.04 90 top
R30  87.47,75.88 270 top
R31  84.77,75.88 270 top
R32  82.07,75.88 270 top
R35  72.07,79.38 270 top
R36  69.37,79.38 270 top
R37  66.67,79.38 270 top
R38  55.88,78.58 180 top
R39  57.15,81.12 180 top
U1  64.77,67.31 180 top
U2  86.36,66.67 180 top
U3  78.74,81.6 0 top
U$1  54.61,93.98 0 top
X1  3.81,77.47 270 top

### Tracks (layer width: path | path; a pad name or v marks a point on that pad's centre or on a via)
ACLKR
  Bottom 0.254: R31.1 84.77,80.17 86.04,81.44 86.04,85.25 81.28,90.01 81.28,96.2 80.49,97 63.66,97 62.23,95.57 U$1.12
ACLKX
  Top 0.254: R36.1 69.37,81.92 69.85,81.44 72.71,81.44 73.5,82.23 73.5,86.84 74.77,88.11 84.3,88.11 87.63,91.44 U$1.31
AGND
  Top 0.254: U1.46 69.52,59.54 70.48,58.58 C6.2 | C4.1 56.52,65.41 56.99,64.93 59.53,64.93 60.02,64.44 U1.27 60.02,58.75 59.85,58.58 58.8,58.58 C3.-
  Bottom 1.27: 3.81,58.42 3.81,52.07
  pour Bottom (isolate 0.305): 1.27,90.17 1.27,57.15 74.14,57.15 74.14,64.77 44.45,64.77 44.45,90.17
  pour Bottom (isolate 0.305): 1.27,53.34 1.27,1.27 111.76,1.27 111.76,52.07 111.76,53.34
CAPE_I2C_SCL  (via drill 0.8)
  Top 0.254: v78.11,86.68 78.42,86.68 79.06,86.04 U3.6 79.06,83.34 79.38,83.03 81.28,83.03 R8.1
  Bottom 0.254: v78.11,86.68 78.11,87 U$1.19
CAPE_I2C_SDA  (via drill 0.8)
  Top 0.254: U3.5 79.69,84.55 79.69,85.72 80.33,86.36 v80.33,86.68 82.23,86.68 R2.1
  Bottom 0.254: v80.33,86.68 76.2,90.81 76.2,93.5 75.72,93.98 73.66,93.98 U$1.20
DGND  (via drill 0.8)
  Top 0.254: v65.41,73.18 64.77,73.18 64.52,72.93 U1.13 64.52,67.56 U1.EXP | U1.11 65.52,73.07 v65.41,73.18 | v65.41,73.18 66.04,73.18 66.52,72.7 U1.9 | U1.10 66.02,72.57 v65.41,73.18 | 79.85,64.61 C15.2 79.85,64.93 80.49,65.56 84.3,65.56 84.73,65.12 U2.19 | U3.4 79.72,77.81 79.53,77.63 76.52,77.63 75.88,78.26 C11.1 | U2.8 86.03,67.95 v86.2,67.79 87,67.79 87.33,68.13 U2.6 | C2.1 88.42,56.67 88.42,61.12 87.33,62.21 U2.23 87.33,65.11 87.95,65.72 v92.87,65.72
  Bottom 0.254: C1.1 86.84,56.04 C2.1
  pour Bottom (isolate 0.305): 46.99,66.04 74.93,66.04 74.93,63.5 111.76,63.5 111.76,99.06 46.99,99.06
  pour Bottom (isolate 0.305): 1.27,91.44 1.27,99.06 46.99,99.06 46.99,91.44
DIN
  Top 0.254: U$1.30 86.36,93.98 88.42,93.98 88.9,93.5 88.9,91.44 85.09,87.63 85.09,82.39 82.39,79.69 R32.1
DIR_AUDIO
  Top 0.254: U2.1 90.58,70.9 91.44,71.75 91.44,96.52 90.17,97.79 68.58,97.79 67.31,96.52 U$1.16
DOUT  (via drill 0.8)
  Top 0.254: R37.1 66.67,87.63 68.9,89.85 79.69,89.85 80.64,90.81 v83.82,90.81
  Bottom 0.254: v83.82,90.81 98.42,90.81 U$1.41
FILT
  Top 0.254: U2.22 86.68,63.75 86.68,62.71 84.77,60.8 R15.1 C1.2
FSR
  Bottom 0.254: R30.1 87.47,85.25 82.55,90.17 U$1.27
FSX
  Top 0.254: R35.1 72.07,87 73.82,88.74 83.66,88.74 85.09,90.17 U$1.29
MCLK
  Top 0.254: R4.1 63.98,86.36 68.42,90.81 78.11,90.81 U$1.25 U$1.28
N$1
  Top 0.813: X1.4 5.65,69.95 B1.AC2
N$2
  Top 0.254: R3.2 54.13,70.33 54.77,69.69 59.05,69.69 59.52,70.16 U1.23
N$3
  Top 0.813: X1.1 5.61,84.99 B1.AC1
N$4
  Top 0.254: LED1.A 93.35,88.1 R11.1
N$5  (via drill 0.8 pad 0.81)
  Top 0.254: U1.14 64.02,75.52 R4.2 | U2.4 88.64,70.54 89.38,71.28 89.38,73.66 88.11,74.93 v77.47,74.93
  Bottom 0.254: v77.47,74.93 76.2,74.93 73.66,77.47 64.29,77.47 63.98,77.15 R4.2
N$6
  Top 0.254: C2.2 84.3,56.04 86.84,58.58 R15.2
N$7
  Top 0.254: U2.25 88.64,62.02 90.17,60.48 JP1.2
N$8
  Top 0.254: U2.26 89.28,62.8 89.85,62.23 91.76,62.23 92.71,61.28 JP1.1
N$9
  Top 0.61: 3_R4.1 3_R5.2 73.66,34.45 72.55,35.56 3_C4.1 3_R2.2
N$10
  Top 0.61: 3_R1.2 3_C4.2 77.95,35.56 78.74,34.77 3_R6.1 3_R3.1 76.2,31.75 74.93,30.48 3_C3.1
N$11
  Top 0.254: U1.18 62.02,69.48 61.91,69.37 61.12,69.37 60.17,68.42 49.69,68.42 48.9,69.22 R5.2
N$12
  Top 1.016: L1.1 103.35,64.61 100.81,67.15 C10.2 98.74,69.85 | 98.74,69.85 98.74,70.1 103.28,70.1 103.98,70.8 P1.3 | C16.+ 98.49,70.1 98.74,69.85
N$13
  Top 0.61: 1_R2.2 1_C4.1 97.47,35.56 97.79,35.24 1_R5.2 1_R4.1
N$14
  Top 0.61: 2_R4.1 2_C4.1 2_R2.2 2_R5.2
N$15
  Top 0.61: 2_C3.1 2_R6.1 | 2_R3.1 2_R6.1 | 2_R6.1 2_C4.2 2_R1.2
N$16
  Top 0.61: 3_R4.2 71.12,21.43 72.23,20.32 IC4.3 74.93,20.32 76.99,22.38 3_C5.2
N$17
  Top 0.254: U1.19 61.52,70.09 61.44,70.01 60.96,70.01 60.01,69.06 52.23,69.06 51.44,69.85 R6.2
N$18
  Top 0.61: 1_R1.2 1_C4.2 102.23,35.56 102.87,34.92 1_R6.1 1_R3.1 100.33,31.75 99.06,30.48 1_C3.1
N$19
  Top 0.254: U1.24 59.02,71.95 58.26,72.71 R7.2
N$20
  Top 0.254: P1.1 94.46,77.31 93.5,76.36 93.5,69.06 90.81,66.36 87.79,66.36 86.68,65.25 86.04,65.25 85.39,64.59 U2.20
N$21
  Top 0.61: 76.2,15.24 77.47,15.24 78.74,16.51 78.74,19.05 80.01,20.32 80.01,24.13 3_R6.2 78.74,26.67 77.47,27.94 69.85,27.94 68.58,26.67 3_C3.2 | 76.2,15.24 IC4.1 | 3_R7.1 76.2,15.24
N$22
  Top 0.61: IC4.2 74.93,17.78 78.74,21.59 78.74,23.18 77.47,24.45 77.15,24.45 3_R3.2
N$23
  Top 0.61: 1_R3.2 100.81,25.4 103.35,22.86 103.35,22.23 98.9,17.78 IC1.2
N$24
  Top 0.61: 1_R4.2 95.25,21.59 96.52,20.32 IC1.3 98.74,20.32 101.12,22.7 1_C5.2
N$25
  Top 0.61: 1_R2.1 96.52,44.77 97.16,44.13 102.87,44.13 103.19,44.45 103.19,46.67 101.98,47.88 1_C2.+
N$26
  Top 0.61: 100.33,15.24 101.76,15.24 102.71,16.19 102.71,19.53 104.78,21.59 104.78,23.5 1_R6.2 102.87,26.67 101.6,27.94 93.98,27.94 92.71,26.67 1_C3.2 | 100.33,15.24 IC1.1 | 1_R7.1 100.33,15.24
N$27
  Top 0.61: 1_R1.1 99.22,45.72 97.06,47.88 1_C1.+
N$28
  Top 0.254: LED1.C 98.11,85.09 98.58,85.57 Q2.D
N$29
  Top 0.61: 7_R4.1 7_R5.2 22.86,34.29 7_C4.1 7_R2.2
N$30
  Top 0.61: 2_R4.2 90.17,24.13 IC1.5 2_C5.2
N$31
  Top 0.61: 2_C3.2 82.55,27.94 83.82,26.67 2_R6.2 83.82,16.51 84.61,15.72 87,15.72 | IC1.7 89.53,17.78 87.47,15.72 87,15.72 | 2_R7.1 87,15.72
N$32
  Top 0.61: IC1.6 86.36,20.32 85.09,21.59 85.09,24.13 2_R3.2
N$33
  Top 0.61: 2_R2.1 2_C2.+
N$34
  Top 0.61: 2_R1.1 2_C1.+
N$35
  Top 0.61: 7_C3.1 7_R6.1 | 7_R6.1 7_R3.1 | 7_R6.1 27.94,34.29 7_C4.2 7_R1.2
N$36
  Top 0.61: 7_R4.2 20.32,21.59 21.59,20.32 IC6.3 24.29,20.32 26.19,22.23 7_C5.2
N$37
  Top 0.254: OUT1.2 99.85,3.17 100.33,3.65 1_R7.2
N$38
  Top 0.254: 2_R7.2 90.96,6.35 91.76,5.56 OUT2.2
N$39
  Top 0.813: D6.C IC2.3 C26.1 31.75,76.04 30,74.3 27.3,74.3 25.4,76.2 25.4,83.34 23.18,85.57 C24.+ | C19.1 IC7.3 33.02,92.71 31.75,91.44 20.64,91.44 | 20.64,91.44 15.24,91.44 13.97,92.71 D1.C | C24.+ 20.64,91.44 | B1.+ 16.51,84.97 20.04,84.97 C24.+
  Top 1.016: C17.+ 16.51,75.41 16.51,84.97
N$40
  Top 0.813: R10.2 R12.1 IC7.1
N$41
  Top 0.813: IC3.2 D5.A C27.2
  Top 1.016: C25.- 5.87,65.2 B1.- 11.32,69.96 19.05,62.23 21.59,62.23 26.67,67.31 C27.2
N$42
  Top 0.813: R26.2 43.18,68.58 41.91,69.85 C33.- IC3.1 R23.1
N$43
  Top 0.813: IC2.1 R24.2 37.94,89.53 | 37.94,89.53 38.1,89.53 39.37,88.27 R25.1 | C34.+ 39.05,90.65 37.94,89.53
N$44
  Top 0.61: 3_R2.1 72.39,44.45 72.71,44.13 79.22,44.13 79.38,44.29 79.38,46.51 78.01,47.88 3_C2.+
N$45
  Top 0.61: 3_C1.+ 72.77,47.88 74.93,45.72 3_R1.1
N$46
  Top 0.61: 7_C3.2 29.21,27.94 27.94,26.67 7_R6.2 29.21,24.13 29.21,20.32 27.94,19.05 27.94,16.51 26.67,15.24 25.4,15.24 | 25.4,15.24 IC6.1 | 7_R7.1 25.4,15.24
N$47
  Top 0.61: IC6.2 24.13,17.78 27.94,21.59 27.94,23.18 26.04,25.08 25.72,25.08 7_R3.2
N$48
  Top 0.61: 4_R4.1 4_C4.1 4_R2.2 4_R5.2
N$49
  Top 0.61: 4_C3.1 4_R6.1 | 4_R6.1 4_R3.1 | 4_R6.1 4_C4.2 4_R1.2
N$50
  Top 0.61: 4_R4.2 66.04,24.13 IC4.5 4_C5.2
N$51
  Top 0.254: U2.12 83.44,70.71 R32.2
N$52
  Top 0.254: U2.11 84.08,70.91 84.77,71.6 R31.2
N$53
  Top 0.254: U2.10 84.73,70.29 85.09,70.64 86.52,70.64 87.95,72.07 R30.2
N$54
  Top 0.254: R9.1 79.85,81.76 79.06,80.96 U3.3
N$55
  Top 0.61: 4_C3.2 58.9,27.94 59.69,27.15 4_R6.2 59.69,16.51 60.96,15.24 62.87,15.24 | IC4.7 65.41,17.78 62.87,15.24 | 4_R7.1 62.87,15.24
N$56
  Top 0.61: IC4.6 62.23,20.32 60.96,21.59 60.96,24.13 4_R3.2
N$57
  Top 0.61: 4_R2.1 4_C2.+
N$58
  Top 0.61: 4_R1.1 4_C1.+
N$59
  Top 0.61: 7_R2.1 21.59,44.45 22.07,43.97 28.26,43.97 28.57,44.29 28.57,46.83 27.53,47.88 7_C2.+
N$60
  Top 0.61: 7_C1.+ 21.97,47.88 24.13,45.72 7_R1.1
N$61
  Top 0.254: U1.8 67.02,75.22 R37.2
N$62
  Top 0.254: U1.7 67.52,73.71 R36.2
N$63
  Top 0.254: U1.6 68.02,73.26 68.58,73.82 70.33,73.82 R35.2
N$64
  Top 0.254: OUT3.2 75.41,3.17 76.2,3.97 3_R7.2
N$65
  Top 0.254: 4_R7.2 66.99,6.19 67.63,5.56 OUT4.2
N$66
  Top 0.61: 5_R4.1 5_R5.2 49.53,34.29 5_C4.1 5_R2.2
N$67
  Top 0.61: 5_R1.2 5_C4.2 54.61,34.29 5_R6.1 5_R3.1 52.07,31.75 50.8,30.48 5_C3.1
N$68
  Top 0.61: 5_R4.2 46.99,21.59 48.26,20.32 IC5.3 50.8,20.32 52.86,22.38 5_C5.2
N$69
  Top 0.61: 52.07,15.24 53.5,15.24 54.61,16.35 54.61,20 56.04,21.43 56.04,23.97 5_R6.2 54.61,26.67 53.34,27.94 45.72,27.94 44.45,26.67 5_C3.2 | 52.07,15.24 IC5.1 | 5_R7.1 52.07,15.24
N$70
  Top 0.61: IC5.2 50.48,17.78 54.93,22.23 54.93,22.86 52.7,25.08 52.39,25.08 5_R3.2
N$71
  Top 0.61: 5_R2.1 48.26,44.77 49.05,43.97 54.77,43.97 55.24,44.45 55.24,46.67 54.04,47.88 5_C2.+
N$72
  Top 0.61: 5_R1.1 50.8,45.72 48.64,47.88 5_C1.+
N$73
  Top 0.61: 8_R4.1 8_C4.1 8_R2.2 8_R5.2
N$74
  Top 0.61: 8_C3.1 8_R6.1 | 8_R6.1 8_C4.2 8_R1.2 | 8_R6.1 8_R3.1
N$75
  Top 0.61: 6_R4.1 6_C4.1 6_R2.2 6_R5.2
N$76
  Top 0.61: 6_C3.1 6_R6.1 | 6_R3.1 6_R6.1 | 6_R6.1 6_C4.2 6_R1.2
N$77
  Top 0.61: 6_C5.2 IC5.5 41.91,24.13 6_R4.2
N$78
  Top 0.61: 6_C3.2 34.29,27.94 35.56,26.67 6_R6.2 35.56,16.51 36.51,15.56 38.73,15.56 | IC5.7 40.96,17.78 38.73,15.56 | 6_R7.1 38.73,15.56
N$79
  Top 0.61: IC5.6 38.1,20.32 36.83,21.59 36.83,24.13 6_R3.2
N$80
  Top 0.61: 6_R2.1 6_C2.+
N$81
  Top 0.61: 6_R1.1 6_C1.+
N$82
  Top 0.254: OUT5.2 51.28,3.17 52.07,3.97 5_R7.2
N$83
  Top 0.254: 6_R7.2 42.7,6.35 43.66,5.4 OUT6.2
N$84
  Top 0.61: 8_C5.2 IC6.5 15.24,24.13 8_R4.2
N$85
  Top 0.61: IC6.7 14.61,17.78 12.06,15.24 | 8_C3.2 7.62,27.94 8.89,26.67 8_R6.2 8.89,16.51 10.16,15.24 12.06,15.24 | 12.06,15.24 8_R7.1
N$86
  Top 0.61: IC6.6 11.43,20.32 10.16,21.59 10.16,24.13 8_R3.2
N$87
  Top 0.61: 8_R2.1 8_C2.+
N$88
  Top 0.61: 8_R1.1 8_C1.+
N$89
  Top 0.254: OUT7.2 24.61,3.17 25.4,3.97 7_R7.2
N$90
  Top 0.254: 8_R7.2 16.03,6.35 17.14,5.24 OUT8.2
N$94
  Bottom 0.254: U$1.42 101.6,93.98 101.6,90.33 Q2.G
RST  (via drill 0.8)
  Top 0.254: U1.15 63.52,72.87 | 63.52,72.87 63.52,73.64 62.23,74.93 62.23,85.72 67.31,90.81 U$1.15 | v62.23,73.03 63.36,73.03 63.52,72.87 | U2.21 86.03,63.02 85.57,62.55 77.15,62.55 v76.2,63.5
  Bottom 0.254: v76.2,63.5 72.39,67.31 63.5,67.31 62.23,68.58 v62.23,73.03
SCL
  Top 0.254: U1.21 60.52,72.04 59.69,72.87 R38.1 58.58,78.58 53.98,83.19 51.91,83.19 50.32,84.77 LCD.4
  Bottom 0.254: R38.1 59.69,83.82 66.04,90.17 68.58,90.17 69.85,91.44 U$1.17
SDA
  Top 0.254: LCD.3 52.86,85.41 57.15,81.12 R39.1 61.02,81.06 U1.20
  Bottom 0.254: R39.1 60.96,83.82 66.04,88.9 68.58,88.9 71.12,91.44 71.12,93.98 U$1.18
V+  (via drill 0.8)
  Top 0.61: v16.51,29.21 v16.51,50.8
  Top 0.813: R25.2 IC2.2 29.84,83.19 29.21,82.55 D7.C 29.21,77.47 28.57,76.83 D6.A | R25.2 41.12,83.19 41.91,83.98 C31.1 | R1.1 44.45,74.93 41.75,74.93 40.64,76.04 C28.+ 39.37,78.42 R25.2
  Bottom 0.61: IC4.8 C40.1 66.04,9.84 | IC1.8 C32.1 90.17,10.16 89.85,9.84 82.55,9.84 | 41.91,9.84 C8.1 IC5.8 | 41.91,9.84 31.75,9.84 | 31.75,9.84 15.72,9.84 15.24,10.32 C9.1 IC6.8 16.51,15.24 17.78,16.51 17.78,24.13 16.51,25.4 v16.51,29.21 | 41.91,9.84 57.15,9.84 | 57.15,9.84 66.04,9.84 | 66.04,9.84 82.55,9.84 | C12.+ 31.75,9.84 | C13.+ 57.15,9.84 | C14.+ 82.55,9.84 | D6.A 27.94,57.15 26.67,55.88 17.78,55.88 16.51,54.61 v16.51,50.8
V-  (via drill 0.8)
  Top 0.61: C9.2 v20.32,8.26 | v71.12,8.26 C40.2 | v46.99,8.26 C8.2 | v18.1,26.67 v18.1,48.74
  Top 0.813: 40.64,64.77 IC3.3 33.02,64.77 32.7,64.45 D5.C C30.2 | 40.64,64.77 R26.1 C29.- | D8.A 40.64,64.77
  Bottom 0.61: C9.2 20.32,22.86 20.48,23.02 | C8.2 46.99,21.59 48.26,22.86 IC5.4 | C40.2 71.12,21.59 72.39,22.86 IC4.4 | IC1.4 96.52,22.86 95.25,21.59 C32.2 95.25,8.89 94.61,8.26 C14.- v71.12,8.26 C13.- v46.99,8.26 C12.- v20.32,8.26 | IC6.4 20.64,22.86 20.48,23.02 | 20.48,23.02 18.1,25.4 v18.1,26.67 | C30.2 30.64,55.88 29.37,54.61 20,54.61 18.1,52.7 v18.1,48.74
VCC
  Top 0.254: U1.47 70.01,64.93 70.64,65.56 72.39,65.56 72.87,65.09 C6.1 | U1.25 59.02,62.35 58.42,61.75 C4.2
  Bottom 0.406: C6.1 72.87,62.23 72.39,61.75 C4.2 47.94,61.75 46.99,62.71 46.99,74.93 R1.2
VCOM
  Top 0.254: C3.+ 59.28,60.55 59.52,60.79 U1.26
VDD
  Top 0.254: U1.12 65.02,69.92 65.41,69.53 71.91,69.53 C5.2 | 88.27,75.56 90.17,77.47 R9.2 R8.2 R2.2 | U2.5 87.98,67.35 87.15,66.52 80.49,66.52 79.85,67.15 79.85,68.58 79.45,68.98
  Top 0.813: C11.2 75.88,82.39 74.14,80.64 74.14,76.99 75.56,75.56 75.56,68.58
  Top 1.016: C15.1 79.45,68.98 79.06,68.58 76.26,68.58 C7.+ 76.14,68.58 75.56,68.58 C5.2
  pour Top (isolate 0.305): 46.99,99.06 46.99,66.04 74.93,66.04 74.93,54.61 111.76,54.61 111.76,99.06
VDD_5V
  Top 0.813: 41.91,95.25 IC7.2 R12.2 31.75,93.98 30.48,92.71 26.67,92.71 25.4,93.98 C20.+ D1.A D2.C | 41.91,95.25 44.45,97.79 53.34,97.79 54.61,96.52 U$1.6 U$1.5 54.61,91.28 57.94,87.95 LCD.1 | C21.1 42.07,95.09 41.91,95.25
VOUT1+
  Top 0.254: U1.43 68.02,55.65 70.01,53.66 88.9,53.66 90.65,51.91 95.57,51.91 96.52,50.96 1_C1.-
VOUT1-
  Top 0.254: U1.44 68.52,55.94 70.17,54.29 89.69,54.29 90.65,53.34 100.33,53.34 101.6,52.07 1_C2.-
VOUT2+
  Top 0.254: U1.41 67.02,53.63 68.58,52.07 80.9,52.07 83.06,49.91 2_C1.-
VOUT2-
  Top 0.254: 88.9,49.53 2_C2.- 87.69,51.12 82.87,51.12 81.28,52.7 69.22,52.7 67.52,54.4 U1.42
VOUT3+
  Top 0.254: U1.39 66.02,50.34 66.45,49.91 3_C1.-
VOUT3-
  Top 0.254: U1.40 66.52,52.23 67.47,51.28 76.2,51.28 77.47,50.01 3_C2.-
VOUT4+
  Top 0.254: U1.37 65.02,52.32 64.77,52.07 60.96,52.07 59.69,50.8 4_C1.-
VOUT4-
  Top 0.254: U1.38 65.52,50.66 4_C2.-
VOUT5+
  Top 0.254: U1.35 64.02,54.97 62.55,53.5 49.69,53.5 48.26,52.07 5_C1.-
VOUT5-
  Top 0.254: U1.36 64.52,53.57 63.66,52.7 53.98,52.7 53.34,52.07 5_C2.-
VOUT6+
  Top 0.254: U1.33 63.02,55.88 61.91,54.77 36.04,54.77 35.56,54.29 6_C1.-
VOUT6-
  Top 0.254: U1.34 63.52,55.42 62.23,54.13 41.12,54.13 40.64,53.66 6_C2.-
VOUT7+
  Top 0.254: U1.31 62.02,57.1 60.96,56.04 22.07,56.04 21.59,55.56 7_C1.-
VOUT7-
  Top 0.254: U1.32 62.52,56.33 61.59,55.4 27.15,55.4 26.67,54.93 7_C2.-
VOUT8+
  Top 0.254: U1.29 61.02,58 60.33,57.31 20.48,57.31 17.78,54.61 11.43,54.61 8.89,52.07 8_C1.-
VOUT8-
  Top 0.254: U1.30 61.52,57.55 60.64,56.67 20.95,56.67 20.95,56.52 17.78,53.34 15.24,53.34 13.97,52.07 8_C2.-

### Text on the board
tPlace: 1 | 2 | OPN | OPN | 16b rjust | OPN | CLS | 24b rjust | CLS | OPN | 24b ljust | CLS | CLS | 24b I2S | Beagle Bone multi-channel audio decoder / Designed by Halfgaar, (C) 2017, 2018, GNU GPL v2 / Ver 3: 2018-03-04 | GND | GND | GND | GND